# Altium schematic sheet NTC_MUX.SchDoc
size A4
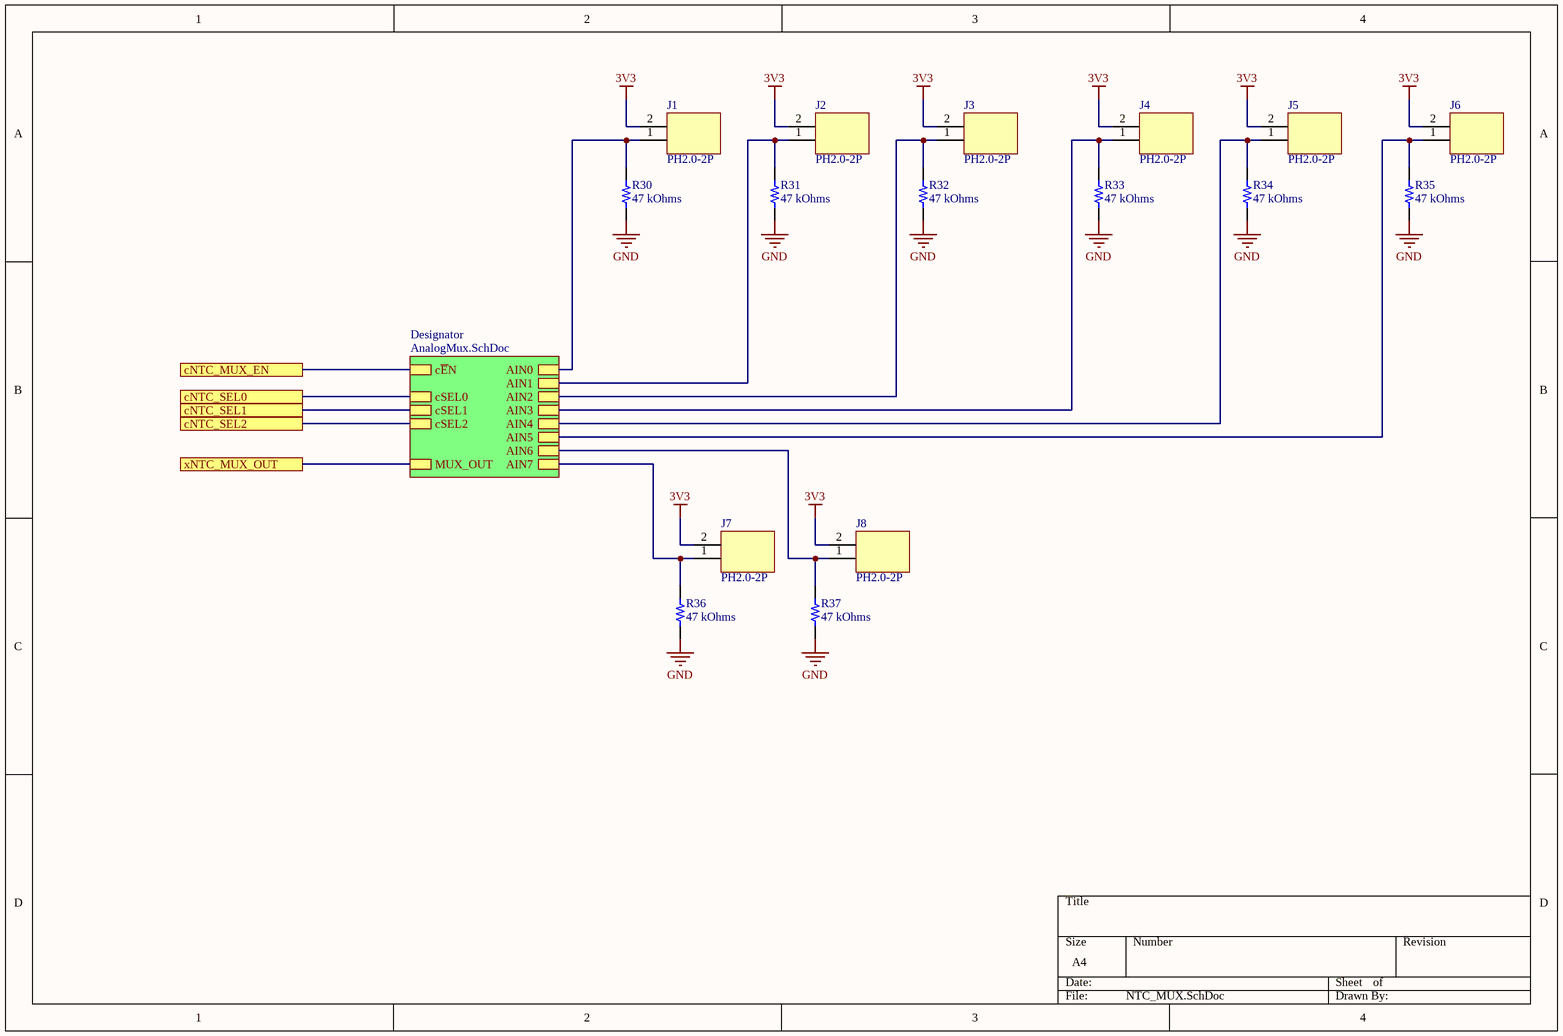
[diagram p0: NTC_MUX.SchDoc]

## Parts
J1  PH2.0-2P  [PH2.0-2P]
J2  PH2.0-2P  [PH2.0-2P]
J3  PH2.0-2P  [PH2.0-2P]
J4  PH2.0-2P  [PH2.0-2P]
J5  PH2.0-2P  [PH2.0-2P]
J6  PH2.0-2P  [PH2.0-2P]
J7  PH2.0-2P  [PH2.0-2P]
J8  PH2.0-2P  [PH2.0-2P]
R30  47 kOhms  [RES 0805_2012]
R31  47 kOhms  [RES 0805_2012]
R32  47 kOhms  [RES 0805_2012]
R33  47 kOhms  [RES 0805_2012]
R34  47 kOhms  [RES 0805_2012]
R35  47 kOhms  [RES 0805_2012]
R36  47 kOhms  [RES 0805_2012]
R37  47 kOhms  [RES 0805_2012]

## Sub-sheets
Designator = AnalogMux.SchDoc: cSEL1, AIN7, AIN1, AIN0, MUX_OUT, AIN6, cSEL0, AIN4, AIN5, AIN3, AIN2, cSEL2, c~{E}N

## Ports
cNTC_MUX_EN, cNTC_SEL0, cNTC_SEL1, cNTC_SEL2, xNTC_MUX_OUT

## Nets
3V3: J1.2 J2.2 J3.2 J4.2 J5.2 J6.2 J7.2 J8.2
GND: R30.1 R31.1 R32.1 R33.1 R34.1 R35.1 R36.1 R37.1
cNTC_MUX_EN: port cNTC_MUX_EN, sheet Designator/c~{E}N
cNTC_SEL0: port cNTC_SEL0, sheet Designator/cSEL0
cNTC_SEL1: port cNTC_SEL1, sheet Designator/cSEL1
cNTC_SEL2: port cNTC_SEL2, sheet Designator/cSEL2
xNTC_MUX_OUT: port xNTC_MUX_OUT, sheet Designator/MUX_OUT
NetJ1_1: J1.1 R30.2 ; sheet Designator/AIN0
NetJ2_1: J2.1 R31.2 ; sheet Designator/AIN1
NetJ3_1: J3.1 R32.2 ; sheet Designator/AIN2
NetJ4_1: J4.1 R33.2 ; sheet Designator/AIN3
NetJ5_1: J5.1 R34.2 ; sheet Designator/AIN4
NetJ6_1: J6.1 R35.2 ; sheet Designator/AIN5
NetJ7_1: J7.1 R36.2 ; sheet Designator/AIN7
NetJ8_1: J8.1 R37.2 ; sheet Designator/AIN6

## Library data of the parts
R30-R37 = RT0805DRD0747KL: RES SMD 47K OHM 0.5% 1/8W 0805; Manufacturer: Yageo; Power (Watts): 0.125W, 1/8W; Temperature Coefficient: ±25ppm/°C; Part Number: RT0805DRD0747KL; Value: 47 kOhms; ComponentLink1Description: Datasheet; ComponentLink1URL: https://www.yageo.com/upload/media/product/productsearch/datasheet/rchip/PYu-RT_1-to-0.01_RoHS_L_11.pdf; ComponentLink2Description: DigiKey Link; ComponentLink2URL: http://digikey.com/product-detail/en/yageo/RT0805DRD0747KL/311-2747-1-ND/6129166; Composition: Thin Film; Device Package: 0805 (2012 Metric); Height - Seated (Max): 0.024" (0.60mm); LastUpdated: 02.09.2020 01:15:24; Lifecycle Status: Active; Minimum Order: 1; Number of Terminations: 2; Operating Temperature: -55°C ~ 155°C; Package / Case: 0805 (2012 Metric); Packaging: TapeAndReel; PartId: 27804; Part Status: Active; Price: 0.03; Resistance: 47 kOhms; Series: RT; Size / Dimension: 0.079" L x 0.049" W (2.00mm x 1.25mm); Supplier 1: DigiKey; Supplier Part Number 1: 311-2747-1-ND; Supplier Device Package: 0805; Tolerance: ±0.5%